# EAGLE board DVRpowerSupply (EAGLE 6.5.0)
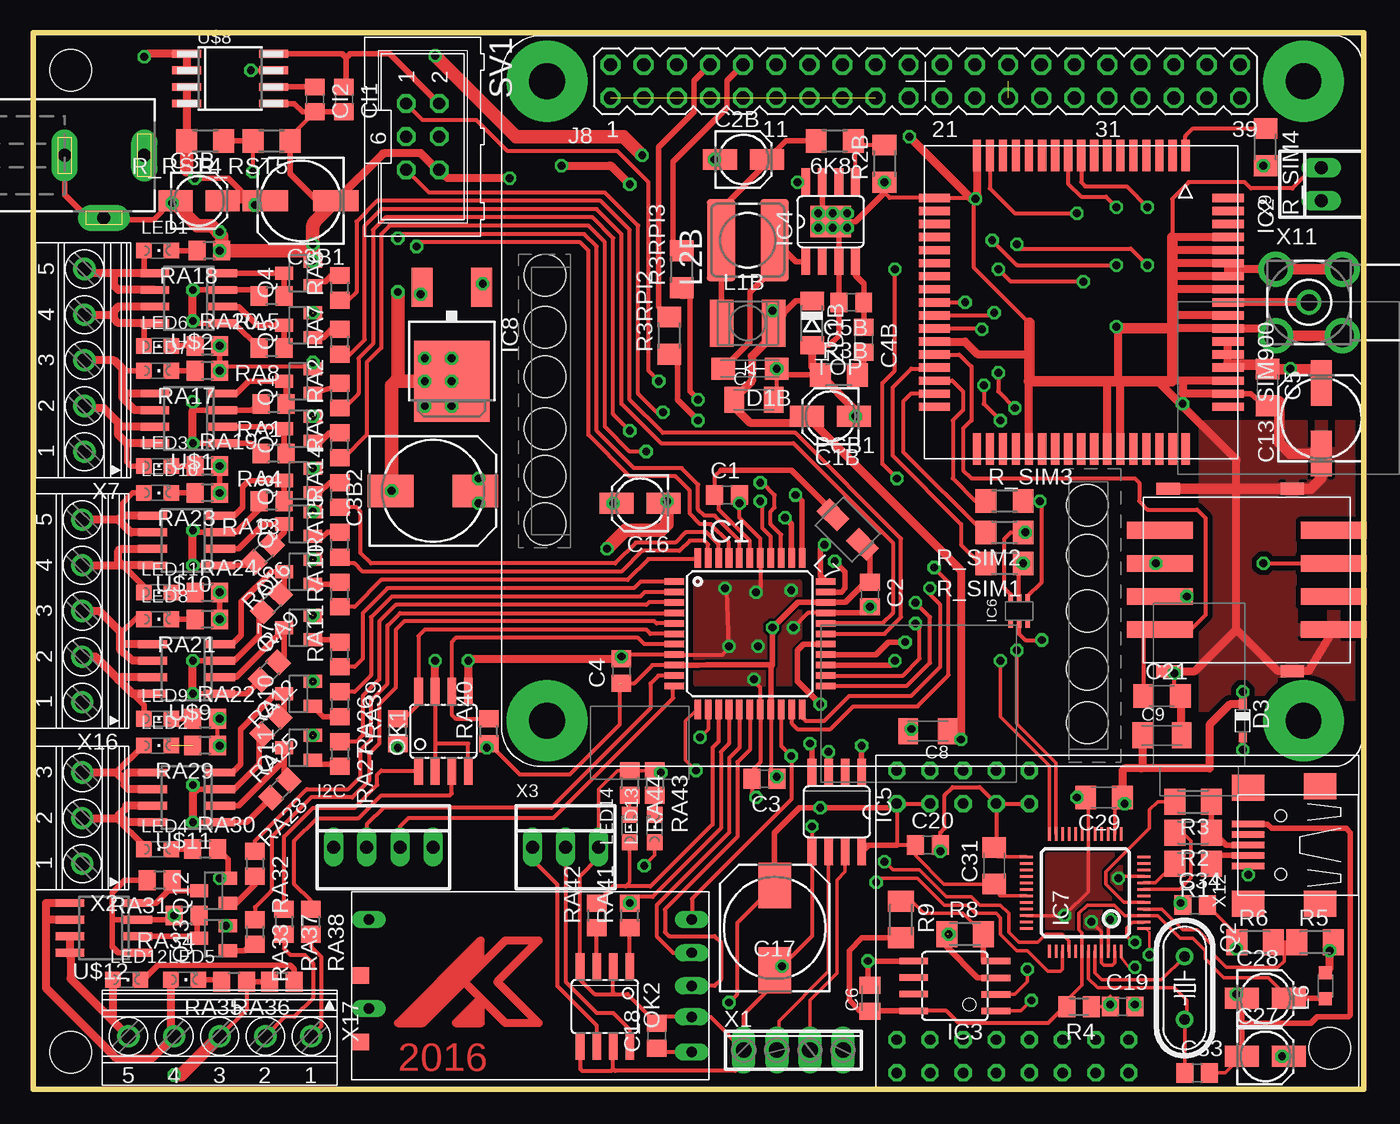
[diagram p2: board, top side]
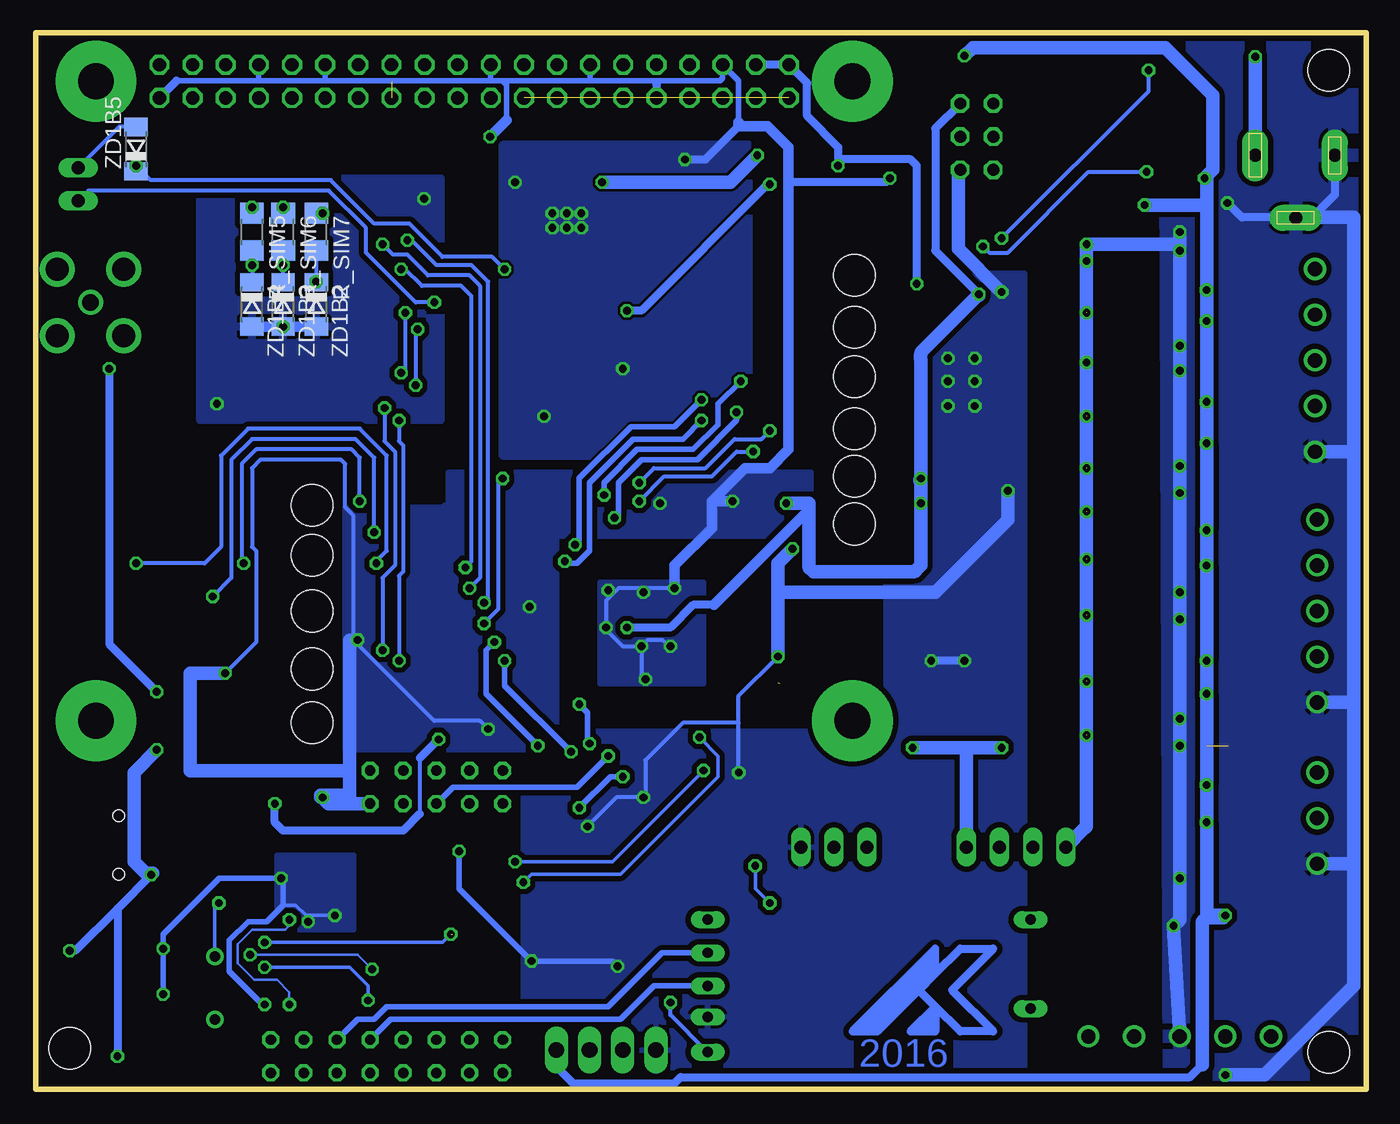
[diagram p3: board, bottom side, seen from below]

Size 102 x 81 mm. Coordinates in mm from the lower left corner, seen from the top.
Outline: 0,0 102,0 102,81 0,81 0,0
Copper layers (1*16): Top 0.035mm / dielectric 1.5mm / Bottom 0.035mm
Design rules "default *": minimum track width 10mil, minimum drill 22mil, track to track 8mil, track to pad 8mil, pad to pad 8mil, via to via 8mil, smd to smd 0mil, copper to edge 8mil, drill to drill 8mil, minimum pad ring 10mil, minimum via ring 8mil, stop-mask expansion 4mil, vias tented up to drill 10mil, thermal gap 10mil
Holes 3.2 mm at 2.86,78.11 2.86,2.86 99.38,3.17 39.21,62.39 39.21,58.42 39.21,54.61 39.21,50.64 39.21,46.99 39.21,43.34 80.8,44.77 80.8,40.96 80.8,36.67 80.8,32.23 80.8,28.1

## Footprints (pad centres in the part's own frame; a part is rotated, then mirrored left to right if it is on the bottom)
R1206 = smd 1.6 x 1.803: 1 -1.422,0; 2 1.422,0
C0805 = smd 1.3 x 1.5: 1 -0.95,0; 2 0.95,0
153CLV-0405 = smd 2.6 x 1.6: + 1.8,0; - -1.8,0
153CLV-0605 = smd 3.5 x 1.6: + 2.7,0; - -2.7,0
150CLZ-0810 = smd 3.5 x 2.5: + 3.25,0; - -3.25,0
C1206 = smd 1.6 x 1.8: 1 -1.4,0; 2 1.4,0
C0805K = smd 1.3 x 1.6: 1 -1,0; 2 1,0
C1206K = smd 1.5 x 2: 1 -1.5,0; 2 1.5,0
140CLH-0810 = smd 3.5 x 2.5: + 3.25,0; - -3.25,0
SMA-DO214AC = smd 1.8 x 1.7: A -2.05,0; K 2.05,0
SOD323_ST = smd 0.8 x 0.6: A 1.25,0; C -1.25,0
22-23-2041 = drill 1 long: 1 -3.81,0; 2 -1.27,0; 3 1.27,0; 4 3.81,0
TQFP44 = smd 1.5 x 0.5: 1 -5.8,4; 2 -5.8,3.2; 3 -5.8,2.4; 4 -5.8,1.6; 5 -5.8,0.8; 6 -5.8,0; 7 -5.8,-0.8; 8 -5.8,-1.6; 9 -5.8,-2.4; 10 -5.8,-3.2; 11 -5.8,-4; 23 5.8,-4; 24 5.8,-3.2; 25 5.8,-2.4; 26 5.8,-1.6; 27 5.8,-0.8; 28 5.8,0; 29 5.8,0.8; 30 5.8,1.6; 31 5.8,2.4; 32 5.8,3.2; 33 5.8,4 | smd 0.5 x 1.5: 12 -4,-5.8; 13 -3.2,-5.8; 14 -2.4,-5.8; 15 -1.6,-5.8; 16 -0.8,-5.8; 17 0,-5.8; 18 0.8,-5.8; 19 1.6,-5.8; 20 2.4,-5.8; 21 3.2,-5.8; 22 4,-5.8; 34 4,5.8; 35 3.2,5.8; 36 2.4,5.8; 37 1.6,5.8; 38 0.8,5.8; 39 0,5.8; 40 -0.8,5.8; 41 -1.6,5.8; 42 -2.4,5.8; 43 -3.2,5.8; 44 -4,5.8
SIM900 = smd 2.413 x 0.635: 1 -11.25,8; 2 -11.25,7; 3 -11.25,6; 4 -11.25,5; 5 -11.25,4; 6 -11.25,3; 7 -11.25,2; 8 -11.25,1; 9 -11.25,0; 10 -11.25,-1; 11 -11.25,-2; 12 -11.25,-3; 13 -11.25,-4; 14 -11.25,-5; 15 -11.25,-6; 16 -11.25,-7; 17 -11.25,-8; 35 11.25,-8; 36 11.25,-7; 37 11.25,-6; 38 11.25,-5; 39 11.25,-4; 40 11.25,-3; 41 11.25,-2; 42 11.25,-1; 43 11.25,0; 44 11.25,1; 45 11.25,2; 46 11.25,3; 47 11.25,4; 48 11.25,5; 49 11.25,6; 50 11.25,7; 51 11.25,8 | smd 0.635 x 2.413: 18 -8,-11.25; 19 -7,-11.25; 20 -6,-11.25; 21 -5,-11.25; 22 -4,-11.25; 23 -3,-11.25; 24 -2,-11.25; 25 -1,-11.25; 26 0,-11.25; 27 1,-11.25; 28 2,-11.25; 29 3,-11.25; 30 4,-11.25; 31 5,-11.25; 32 6,-11.25; 33 7,-11.25; 34 8,-11.25; 52 8,11.25; 53 7,11.25; 54 6,11.25; 55 5,11.25; 56 4,11.25; 57 3,11.25; 58 2,11.25; 59 1,11.25; 60 0,11.25; 61 -1,11.25; 62 -2,11.25; 63 -3,11.25; 64 -4,11.25; 65 -5,11.25; 66 -6,11.25; 67 -7,11.25; 68 -8,11.25
SOIC8 = smd 0.5 x 2.2: 1 -1.905,-3.154; 2 -0.645,-3.154; 3 0.625,-3.154; 4 1.895,-3.154; 5 1.905,3.154; 6 0.635,3.154; 7 -0.635,3.154; 8 -1.905,3.154
HSOP8-PAD = smd 0.66 x 2.032: 1 -1.905,-3.073; 2 -0.635,-3.073; 3 0.635,-3.073; 4 1.905,-3.073; 5 1.905,3.073; 6 0.635,3.073; 7 -0.635,3.073; 8 -1.905,3.073 | smd 3.1 x 2.41: P 0,0
SO08 = smd 0.66 x 2.032: 1 -1.905,-3.073; 2 -0.635,-3.073; 3 0.635,-3.073; 4 1.905,-3.073; 5 1.905,3.073; 6 0.635,3.073; 7 -0.635,3.073; 8 -1.905,3.073
SC-70-6 = smd 0.35 x 0.5: 1 -0.65,-1.05; 2 0,-1.05; 3 0.65,-1.05; 4 0.65,1.05; 5 0,1.05; 6 -0.65,1.05
LQFP = smd 0.2 x 1: 1 -2.75,-4.5; 2 -2.25,-4.5; 3 -1.75,-4.5; 4 -1.25,-4.5; 5 -0.75,-4.5; 6 -0.25,-4.5; 7 0.25,-4.5; 8 0.75,-4.5; 9 1.25,-4.5; 10 1.75,-4.5; 11 2.25,-4.5; 12 2.75,-4.5; 25 2.75,4.5; 26 2.25,4.5; 27 1.75,4.5; 28 1.25,4.5; 29 0.75,4.5; 30 0.25,4.5; 31 -0.25,4.5; 32 -0.75,4.5; 33 -1.25,4.5; 34 -1.75,4.5; 35 -2.25,4.5; 36 -2.75,4.5 | smd 1 x 0.2: 13 4.5,-2.75; 14 4.5,-2.25; 15 4.5,-1.75; 16 4.5,-1.25; 17 4.5,-0.75; 18 4.5,-0.25; 19 4.5,0.25; 20 4.5,0.75; 21 4.5,1.25; 22 4.5,1.75; 23 4.5,2.25; 24 4.5,2.75; 37 -4.5,2.75; 38 -4.5,2.25; 39 -4.5,1.75; 40 -4.5,1.25; 41 -4.5,0.75; 42 -4.5,0.25; 43 -4.5,-0.25; 44 -4.5,-0.75; 45 -4.5,-1.25; 46 -4.5,-1.75; 47 -4.5,-2.25; 48 -4.5,-2.75
DPACK = smd 1.6 x 3: 1 -2.28,-4.8; 3 2.28,-4.8 | smd 5.8 x 6.2: 4 0,2.38
DCJ0303 = drill 1 pad 2 long: 1 0,3.1; 2 4.8,0; 3 0,-3
L4532P = smd 1.8 x 3.6: 1 -2,0; 2 2,0
POWER-CHOKE_WE-TPC = smd 6.3 x 2.2: 1 0,2.05; 2 0,-2.05
L2012C = smd 1 x 1: 1 -1,0; 2 1,0
L4035M = smd 2.2 x 1.4: 1 -1.6,0; 2 1.6,0
CHIPLED_0805 = smd 1.2 x 1.2: A 0,-1.05; C 0,1.05
SOIC08 = smd 0.66 x 2.032: 1 -1.905,-3.073; 2 -0.635,-3.073; 3 0.635,-3.073; 4 1.905,-3.073; 5 1.905,3.073; 6 0.635,3.073; 7 -0.635,3.073; 8 -1.905,3.073
RASPBERRY_PI_APLUS_TPLACE = drill 1.016 octagon: 1 8.37,51.23; 2 8.37,53.77; 3 10.91,51.23; 4 10.91,53.77; 5 13.45,51.23; 6 13.45,53.77; 7 15.99,51.23; 8 15.99,53.77; 9 18.53,51.23; 10 18.53,53.77; 11 21.07,51.23; 12 21.07,53.77; 13 23.61,51.23; 14 23.61,53.77; 15 26.15,51.23; 16 26.15,53.77; 17 28.69,51.23; 18 28.69,53.77; 19 31.23,51.23; 20 31.23,53.77; 21 33.77,51.23; 22 33.77,53.77; 23 36.31,51.23; 24 36.31,53.77; 25 38.85,51.23; 26 38.85,53.77; 27 41.39,51.23; 28 41.39,53.77; 29 43.93,51.23; 30 43.93,53.77; 31 46.47,51.23; 32 46.47,53.77; 33 49.01,51.23; 34 49.01,53.77; 35 51.55,51.23; 36 51.55,53.77; 37 54.09,51.23; 38 54.09,53.77; 39 56.63,51.23; 40 56.63,53.77 | drill 2.75 pad 6.2: PE_BL 3.5,3.5; PE_BR 61.5,3.5; PE_TL 3.5,52.5; PE_TR 61.5,52.5
SOT23 = smd 1 x 1.4: 1 -0.95,-1.1; 2 0.95,-1.1; 3 0,1.1
HC49/S = drill 0.813: 1 -2.413,0; 2 2.413,0
M1206 = smd 1.6 x 2: 1 -1.4,0; 2 1.4,0
M0805 = smd 1.3 x 1.6: 1 -0.95,0; 2 0.95,0
R0805 = smd 1.3 x 1.5: 1 -0.95,0; 2 0.95,0
ML6 = drill 0.914 octagon: 1 -2.54,-1.27; 2 -2.54,1.27; 3 0,-1.27; 4 0,1.27; 5 2.54,-1.27; 6 2.54,1.27
SO-08 = smd 0.6 x 2.2: 1 -1.905,-2.6; 2 -0.635,-2.6; 3 0.635,-2.6; 4 1.905,-2.6; 5 1.905,2.6; 6 0.635,2.6; 7 -0.635,2.6; 8 -1.905,2.6
HC-12 = drill 0.8 long: P$1 -12.383,5.08; P$2 -12.383,2.381; P$3 -12.383,0; P$4 -12.383,-2.54; P$5 -12.383,-5.08; P$6 12.383,1.746; P$9 12.383,-5.08 | smd 1.27 x 1.27: P$7 13.018,4.286; P$8 13.018,-0.794
XCORE2530 = drill 0.8 octagon: P$1 1.587,1.27; P$1B 1.587,21.907; P$2 1.587,3.81; P$2B 1.587,24.448; P$3 4.128,1.27; P$3B 4.128,21.907; P$4 4.128,3.81; P$4B 4.128,24.448; P$5 6.668,1.27; P$5B 6.668,21.907; P$6 6.668,3.81; P$6B 6.668,24.448; P$7 9.207,1.27; P$7B 9.207,21.907; P$8 9.207,3.81; P$8B 9.207,24.448; P$9 11.748,1.27; P$9B 11.748,21.907; P$10 11.748,3.81; P$10B 11.748,24.448; P$11 14.287,1.27; P$12 14.287,3.81; P$13 16.828,1.27; P$14 16.828,3.81; P$15 19.367,1.27; P$16 19.367,3.81
115R-BCA0 = smd 5.08 x 1.27: C1 1.27,0; C2 1.27,2.54; C3 1.27,5.08; C4 1.27,7.62; C5 14.605,0; C6 14.605,2.54; C7 14.605,5.08; C8 14.605,7.62 | smd 1.778 x 0.914: P$1 1.905,10.795; P$2 1.905,-3.175; P$3 11.43,-3.175; P$4 11.43,10.795
SO-08M = smd 0.6 x 2.2: 1 -1.905,-3.33; 2 -0.635,-3.33; 3 0.635,-3.33; 4 1.905,-3.33; 5 1.905,3.33; 6 0.635,3.33; 7 -0.635,3.33; 8 -1.905,3.33
4POL254 = drill 1.2 long: 1 -3.81,0; 2 -1.27,0; 3 1.27,0; 4 3.81,0
1751251 = drill 1.1 pad 1.7: 1 -3.5,-0.1; 2 0,-0.1; 3 3.5,-0.1
22-23-2031 = drill 1 long: 1 -2.54,0; 2 0,0; 3 2.54,0
1751277 = drill 1.1 pad 1.7: 1 -7,-0.1; 2 -3.5,-0.1; 3 0,-0.1; 4 3.5,-0.1; 5 7,-0.1
22-23-2021 = drill 1 long: 1 -1.27,0; 2 1.27,0
BU-SMA-H = drill 1.27: 1 0,0 | drill 1.778: 2 -2.55,2.55; 3 2.55,2.55; 4 2.55,-2.55; 5 -2.55,-2.55
USB-M-S1 = smd 2.5 x 0.5: D+ 2.75,0; D- 2.75,0.8; GND 2.75,-1.6; ID 2.75,-0.8; VBUS 2.75,1.6 | smd 2.5 x 2: GND@1 -2.75,-4.5; GND@2 -2.75,4.5; GND@3 2.75,-4.4; GND@4 2.75,4.5 | hole 0.9: 0.25,2.25; 0.25,-2.25
SOD80C = smd 1.4 x 1.8: A 1.7,0; C -1.7,0

## Placement (x,y rotation side)
6K8  5k6  [R1206]  61.44,72.71 180 top
C1  [C0805]  53.18,45.56 0 top
C1B  [153CLV-0405]  61.12,51.59 180 top
C2  [C0805]  64.14,37.94 270 top
C2B  [153CLV-0405]  54.45,71.28 0 top
C3  [C0805]  56.04,23.81 180 top
C3B  [153CLV-0405]  12.7,68.1 0 top
C3B1  [153CLV-0605]  20.48,68.1 180 top
C3B2  [150CLZ-0810]  30.64,45.88 0 top
C4  [C0805]  45.09,32.07 90 top
C4B  22nF  [C0805]  63.66,57.47 270 top
C5  100nF  [C1206]  94.61,53.82 270 top
C5B  220pF  [C0805]  62.71,60.33 180 top
C6  [C0805K]  64.14,6.99 90 top
C7  [C1206K]  55.24,52.86 0 top
C8  [C1206K]  68.58,27.46 180 top
C9  [C1206K]  86.52,27.15 0 top
C13  [153CLV-0605]  98.74,51.44 90 top
C16  [153CLV-0405]  46.51,44.93 180 top
C17  [140CLH-0810]  56.83,12.38 90 top
C18  [C0805]  47.78,4.13 90 top
C19  [C0805]  83.5,6.35 0 top
C20  [C0805]  68.58,18.73 0 top
C21  100nF  [C1206]  86.52,30.16 0 top
C27  [153CLV-0405]  94.46,2.54 0 top
C28  [153CLV-0405]  94.46,6.99 0 top
C29  [C1206]  82.07,22.38 180 top
C31  [C1206]  73.66,17.14 90 top
C33  12pf  [C0805]  89.22,1.27 0 top
C34  12pf  [C0805]  89.06,14.13 0 top
CI1  100nF  [C0805]  23.81,75.88 270 top
CI2  1nF  [C0805]  21.59,75.88 270 top
D1B  B350A-13-F  [SMA-DO214AC]  54.93,55.24 180 top
D3  BAT60J  [SOD323_ST]  92.71,28.26 270 top
I2C  [22-23-2041]  26.83,18.57 0 top
IC1  XMEGA16A4A  [TQFP44]  54.93,34.92 0 top
IC2  SIM900  [SIM900]  80.33,60.33 270 top
IC3  AT93C46A-10SQ-2.7  [SOIC8]  70.64,7.94 90 top
IC4  L5973D  [HSOP8-PAD]  61.12,66.52 0 top
IC5  MAX481CSA  [SO08]  61.59,21.27 180 top
IC6  SMF05C  [SC-70-6]  75.56,36.67 0 top
IC7  [LQFP]  80.64,15.08 90 top
IC8  LP2950CDTX-3.3  [DPACK]  32.07,56.67 180 top
J1  [DCJ0303]  5.4,71.6 270 top
L1B  47@1000  [L4532P]  54.77,58.74 0 top
L2B  15µH  [POWER-CHOKE_WE-TPC]  54.77,65.09 90 top
L6  [L2012C]  99.06,7.94 90 top
L7  [L4035M]  62.44,42.91 135 top
LED1  [CHIPLED_0805]  9.53,64.29 270 top
LED2  [CHIPLED_0805]  9.53,26.35 270 top
LED3  [CHIPLED_0805]  9.53,47.78 270 top
LED4  [CHIPLED_0805]  9.53,18.41 270 top
LED5  [CHIPLED_0805]  11.59,8.41 270 top
LED6  [CHIPLED_0805]  9.53,56.99 270 top
LED7  [CHIPLED_0805]  9.53,55.09 270 top
LED8  [CHIPLED_0805]  9.53,36.04 270 top
LED9  [CHIPLED_0805]  9.53,28.42 270 top
LED10  [CHIPLED_0805]  9.53,45.72 270 top
LED11  [CHIPLED_0805]  9.53,38.1 270 top
LED12  [CHIPLED_0805]  7.14,8.41 270 top
LED13  [CHIPLED_0805]  47.62,20 0 top
LED14  [CHIPLED_0805]  45.72,20 0 top
OK1  ILD211  [SOIC08]  31.43,27.46 0 top
OK2  ILD211  [SOIC08]  43.81,6.35 180 top
PCB1  RASPBERRY_PI_B+TPLACE_A  [RASPBERRY_PI_APLUS_TPLACE]  35.88,24.77 0 top
Q1  BC847SMD  [SOT23]  20.32,54.29 90 top
Q2  [HC49/S]  88.27,7.78 270 top
Q3  BC847SMD  [SOT23]  20.32,50.64 90 top
Q4  BC847SMD  [SOT23]  20.32,62.55 90 top
Q5  BC847SMD  [SOT23]  20.32,58.58 90 top
Q6  BC847SMD  [SOT23]  20.32,39.69 90 top
Q7  BC847SMD  [SOT23]  20.32,35.4 90 top
Q8  BC847SMD  [SOT23]  20.32,46.67 90 top
Q9  BC847SMD  [SOT23]  20.32,43.34 90 top
Q10  BC847SMD  [SOT23]  20.32,30.32 90 top
Q11  BC847SMD  [SOT23]  20.32,26.19 90 top
Q12  BC847SMD  [SOT23]  13.81,15.24 90 top
Q13  BC847SMD  [SOT23]  13.81,11.59 90 top
R1  27  [M1206]  88.9,17.3 180 top
R2  27  [M1206]  88.9,19.68 180 top
R2B  3k3  [R1206]  65.25,70.96 90 top
R3  1k5  [M1206]  88.9,22.07 180 top
R3B  4k7  [R1206]  61.75,54.77 0 top
R3RPI2  1k  [R1206]  48.74,57.78 90 top
R3RPI3  1k  [R1206]  49.69,62.87 90 top
R4  470  [M0805]  80.17,6.35 180 top
R5  4k7  [M1206]  98.27,11.27 0 top
R6  10k  [M1206]  93.66,11.27 0 top
R8  2k2  [M1206]  71.44,11.91 0 top
R9  10k  [M1206]  66.52,13.02 270 top
R_RST4  56k  [R1206]  13.18,72.71 180 top
R_RST5  56k  [R1206]  18.26,72.71 180 top
R_SIM1  22  [R1206]  74.45,40.32 180 top
R_SIM2  22  [R1206]  74.45,42.7 180 top
R_SIM3  22  [R1206]  74.45,45.09 0 top
R_SIM4  1k  [R1206]  94.46,72.23 270 top
R_SIM5  1k  [R1206]  85.41,65.72 270 bottom
R_SIM6  1k  [R1206]  83.03,65.72 270 bottom
R_SIM7  1k  [R1206]  80.49,65.72 270 bottom
RA1  1k  [R0805]  18.41,52.55 180 top
RA2  1k  [R0805]  23.5,53.18 90 top
RA3  1k  [R0805]  23.5,49.37 90 top
RA4  1k  [R0805]  18.41,48.74 180 top
RA5  1k  [R0805]  18.26,60.8 180 top
RA6  1k  [R0805]  23.5,61.44 90 top
RA7  1k  [R0805]  23.5,57.31 90 top
RA8  1k  [R0805]  18.26,56.83 180 top
RA9  1k  [R0805]  18.26,37.31 225 top
RA10  1k  [R0805]  23.5,37.94 90 top
RA11  1k  [R0805]  23.5,33.34 90 top
RA12  1k  [R0805]  18.1,32.07 225 top
RA13  1k  [R0805]  18.26,45.09 180 top
RA14  1k  [R0805]  23.5,45.56 90 top
RA15  1k  [R0805]  23.5,41.75 90 top
RA16  1k  [R0805]  17.62,41.12 225 top
RA17  1k  [R0805]  13.34,55.09 180 top
RA18  1k  [R0805]  13.49,64.29 180 top
RA19  1k  [R0805]  13.34,47.78 0 top
RA20  1k  [R0805]  13.34,56.99 0 top
RA21  1k  [R0805]  13.34,36.04 180 top
RA22  1k  [R0805]  13.18,28.42 0 top
RA23  1k  [R0805]  13.34,45.72 180 top
RA24  1k  [R0805]  13.34,38.1 0 top
RA25  1k  [R0805]  18.21,27.89 225 top
RA26  1k  [R0805]  23.5,29.53 270 top
RA27  1k  [R0805]  23.5,25.72 270 top
RA28  1k  [R0805]  18.89,23.02 225 top
RA29  1k  [R0805]  13.18,26.35 180 top
RA30  1k  [R0805]  13.18,18.41 0 top
RA31  1k  [R0805]  9.68,16.03 180 top
RA32  1k  [R0805]  16.99,17.3 270 top
RA33  1k  [R0805]  16.99,12.06 270 top
RA34  1k  [R0805]  11.75,13.34 180 top
RA35  1k  [R0805]  15.4,8.26 180 top
RA36  1k  [R0805]  19.05,8.26 180 top
RA37  1k  [R0805]  19.21,12.86 270 top
RA38  1k  [R0805]  21.27,12.86 270 top
RA39  1k  [R0805]  27.94,27.46 90 top
RA40  1k  [R0805]  34.92,27.46 90 top
RA41  1k  [R0805]  45.72,13.34 90 top
RA42  1k  [R0805]  43.18,13.34 90 top
RA43  1k  [R0805]  47.62,23.5 270 top
RA44  1k  [R0805]  45.72,23.5 270 top
SV1  [ML6]  29.84,73.03 270 top
U$1  AO4801A  [SO-08]  11.91,51.44 90 top
U$2  AO4801A  [SO-08]  11.91,60.64 90 top
U$3  HC-12  [HC-12]  38.1,7.94 180 top
U$4  XCORE2530  [XCORE2530]  64.61,0 0 top
U$5  [LOGO]  34.29,5.71 0 top
U$6  [LOGO]  33.02,5.08 0 bottom
U$7  SCU-W0822XR-06115R-BCA0  [115R-BCA0]  85.09,35.24 0 top
U$8  ACS712SO8  [SO-08M]  15.08,77.47 270 top
U$9  AO4801A  [SO-08]  11.75,32.23 90 top
U$10  AO4801A  [SO-08]  11.75,42.07 90 top
U$11  AO4801A  [SO-08]  11.75,22.38 90 top
U$12  AO4801A  [SO-08]  5.4,12.38 90 top
X1  [4POL254]  58.26,3.02 0 top
X2  1751251  [1751251]  3.65,20.8 90 top
X3  22-23-2031  [22-23-2031]  40.8,18.57 0 top
X7  1751277  [1751277]  3.81,55.88 90 top
X9  22-23-2021  [22-23-2021]  98.74,69.37 90 top
X11  BU-SMA-H  [BU-SMA-H]  97.79,60.33 0 top
X12  [USB-M-S1]  95.89,18.73 180 top
X16  1751277  [1751277]  3.65,36.67 90 top
X17  1751277  [1751277]  14.29,3.97 180 top
ZD1B  5V1  [SOD80C]  59.69,58.74 270 top
ZD1B2  3v6  [SOD80C]  80.49,60.17 270 bottom
ZD1B3  3v6  [SOD80C]  83.03,60.17 270 bottom
ZD1B4  3v6  [SOD80C]  85.41,60.17 270 bottom
ZD1B5  3v6  [SOD80C]  94.3,72.07 90 bottom

## Tracks (layer width: path | path; a pad name or v marks a point on that pad's centre or on a via)
3V3  (1 unrouted)
+3V3  (via drill 0.6)  (1 unrouted)
  Top 0.254: IC7.31 74.1,14.83 C31.1 69.82,15.74 67.63,17.94 C20.1
  Top 0.305: IC1.9 47.45,32.52 46.04,31.11 C4.1 | 44.93,31.11 44.93,27.94 41.12,24.13 37.31,24.13 RA40.1 34.92,26.19 v34.77,26.19 | IC1.19 56.53,24.27 C3.1 | U$4.P$3B U$4.P$1B 66.2,18.73 C20.1 | U$3.P$1 48.1,2.86 C18.1 | v53.34,6.67 53.98,7.3 53.98,12.78 C17.+ | RA39.1 v27.94,26.19
  Top 0.406: 64.14,39.21 62.25,37.33 IC1.31 58.6,37.33 v56.67,35.4 56.67,32.54 | 64.14,39.21 C2.1 64.14,39.21 | IC1.9 50.98,32.52 51.59,32.54 56.67,32.54 | IC1.19 56.53,32.53 56.59,32.46 56.67,32.54 | 64.14,39.21 64.14,41.43 63.5,42.07 63.27,42.07 L7.1 | U$8.8 23.65,79.38 23.97,79.06 | 23.97,79.06 23.97,76.99 CI1.1 | SV1.2 27.3,79.38 24.29,79.38 23.97,79.06 | 66.2,18.73 64.03,18.73 IC5.8 | C17.+ 56.83,19.68 58.74,21.59 v60.33,21.59 65.88,21.59 U$4.P$1B | C3.1 v56.99,23.97
  Top 0.61: v29.69,60.96 29.84,60.62 IC8.3
  Top 0.813: C16.+ v44.45,44.93
  Top 1.016: C3B2.+ 34.05,46.33 arc-45 34.12,46.5 v34.13,46.83
  Bottom 0.305: U$3.P$1 53.34,5.71 v53.34,6.67
  Bottom 0.406: v56.99,23.97 57.94,23.97 v60.33,21.59
  Bottom 0.61: SV1.2 33.02,73.66 33.02,64.29 v29.69,60.96 | 50.01,37.15 51.59,37.15 53.34,35.4 v56.67,35.4
  Bottom 0.813: 50.01,37.15 42.7,44.45
  Bottom 1.016: v44.45,44.93 42.7,44.93 42.7,44.45 42.7,40.11 arc-45 42.63,39.93 42.39,39.69 34.71,39.69 arc-45 34.53,39.76 34.13,40.16 v34.13,44.93 34.13,46.57 arc45 34.22,46.75 v34.13,46.83 34.13,55.91 arc45 34.06,56.57 29.76,60.87 arc-45 29.69,60.89 v29.69,60.96 | v27.94,26.19 30.64,26.19 | 30.64,26.19 v34.77,26.19 | I2C.4 30.64,26.19
+5V  (via drill 0.6)
  Top 0.254: IC7.14 82.89,21.8 C29.1 83.47,23.15
  Top 0.305: 83.5,22.41 C29.1 83.66,22.2 v83.66,21.91 | IC2.55 96.92,55.33 v96.36,55.24 | C8.1 70.48,27.46 v71.12,26.83
  Top 0.406: ZD1B.C 58.47,60.44 57.44,59.4 L1B.2 56.77,57.88
  Top 0.61: 56.77,57.88 55.09,56.2 55.09,54.29 53.82,53.02 53.82,52.86 | 53.82,52.86 53.82,52.23 54.93,51.12 58.9,51.12 59.32,51.54 C1B.+ 71.12,39.79 v71.12,26.83 | 91.58,55.53 IC2.55 IC2.56 IC2.57 | IC8.1 34.35,62.29 v34.45,61.75 | v40.48,70.8 44.19,70.8 arc-45 44.37,70.73 v45.72,69.37 | v56.67,59.69 57.15,59.69 57.44,59.4 | 84.93,24.61 90.17,24.61 90.17,27.94 91.74,29.51 D3.C v92.71,30.48 | 84.93,24.61 83.66,24.61 83.5,24.45 83.5,22.41 | C9.1 85.02,24.69 84.93,24.61 | C7.1 53.82,52.86
  Top 0.813: 91.58,55.53 94.59,55.53 94.61,55.56 C5.1 98.74,55.22 C13.+
  Bottom 0.305: 72.55,25.4 72.55,21.11
  Bottom 0.61: v34.45,61.75 34.45,70.8 34.92,71.28 40.48,71.28 v40.48,70.8 40.48,72.23 42.86,74.61 42.86,77.15 PCB1.2 PCB1.4 | v45.72,69.37 45.88,69.37 55.56,59.69 v56.67,59.69 | v71.12,26.83 72.55,25.4 | 72.55,21.11 73.82,19.84 83.03,19.84 83.66,20.48 v83.66,21.91 | v96.36,55.24 96.36,34.13 v92.71,30.48
+12V  (via drill 0.6)
  Top 0.406: RA1.2 16.67,52.07 U$1.3 12.22,52.07 v12.22,52.7 | v12.22,49.53 U$1.1 16.67,49.53 RA4.2 | RA5.2 16.83,61.28 U$2.3 v12.22,61.28 | RA8.2 15.4,58.74 U$2.1 12.22,58.74 v12.22,58.9 | 15.56,42.7 U$10.3 12.38,42.7 | 15.56,42.7 | 15.56,42.7 17.31,44.45 RA13.2 | 17.14,40.16 17.15,40.16 RA16.2 17.3,40.01 17.14,40.16 | U$9.1 12.54,30.32 | 12.38,42.7 12.22,42.7 | v12.22,40.16 U$10.1 17.14,40.16 | v12.22,32.86 U$9.3 15.4,32.86 17.3,34.77 17.31,36.35 RA9.2 | U$9.1 16.35,30.32 RA12.2 | RA25.2 17.3,26.67 17.3,24.92 15.4,23.02 U$11.3 12.54,23.02 | U$11.1 16.35,20.48 RA28.2 | RA31.2 6.99,16.03 6.03,15.08 6.03,13.02 | 6.03,13.02 6.03,10.95 6.51,10.48 U$12.1 | 6.03,13.02 U$12.3 10.48,13.02 RA34.2 v10.79,13.34 | 12.54,69.85 v12.38,69.85 12.38,69.69 12.54,69.85 | 12.54,69.85 14.92,69.85 15.88,68.9 15.88,68.16 C3B.+ C3B1.+ | 11.75,72.23 R_RST4.2 | 12.22,20.8 12.54,20.48 U$11.1 | U$11.1 v12.22,20.48 | U$9.1 v12.22,30.32 | v12.22,42.86 12.38,42.7
  Top 0.61: 12.54,30.32 12.22,30.64 v12.22,32.86 | v12.22,40.16 12.22,42.7 | v12.22,49.53 12.22,52.07 | v12.22,58.9 v12.22,61.28 | 11.75,70.48 v12.38,69.85 | U$8.3 U$8.4 11.75,72.23 | 12.22,20.8 12.22,22.7 12.54,23.02 v12.22,23.34 | 10.48,13.02 RA34.2 v10.79,13.34 | IC4.8 58.64,69.59 v58.58,69.53
  Top 1.016: R_RST4.2 11.75,70.48 | v46.67,71.6 45.24,73.03 36.99,73.03 v30.8,79.22
  Bottom 0.61: 12.22,69.69 v12.38,69.85 | X1.4 62.07,1.75 60.8,0.48 53.02,0.48 52.55,0.95 13.49,0.95 12.54,1.91 | v10.79,13.34 10.96,13.18
  Bottom 1.016: 12.22,67.79 v12.22,61.28 v12.22,58.9 v12.22,52.7 v12.22,49.53 v12.22,42.86 v12.22,40.16 v12.22,32.86 v12.22,30.32 v12.22,23.34 v12.22,20.48 12.22,13.34 v10.79,13.34 | 12.22,67.79 12.22,69.69 | 12.54,1.91 12.54,12.86 12.22,13.18 10.96,13.18 | v58.58,69.53 48.74,69.53 v46.67,71.6 | v30.8,79.22 30.16,79.85 15.4,79.85 11.75,76.2 11.75,70.48 v12.38,69.85 | 12.22,67.79 v16.99,67.79
AVCC
  Top 0.254: 52.55,45.08 C1.1
  Top 0.305: IC1.39 54.93,42.07 52.55,44.45 52.55,45.08 | 52.7,47.47 52.23,46.99 52.23,45.09 C1.1
  Top 0.406: 52.7,47.47 58.1,47.47 61.82,43.74 61.73,43.65 L7.2
COMP2
  Top 0.406: IC4.4 63.02,62.39 63.66,61.75 C5B.1 63.66,58.26 C4B.1
CPU_RST  (via drill 0.6)
  Top 0.305: v48.26,51.91 47.78,51.91 46.35,53.34 46.35,66.2 43.81,68.74 30.32,68.74 SV1.5
  Top 0.406: IC1.35 58.13,43.31 v57.63,43.81
  Bottom 0.406: v57.63,43.81 57.31,44.13 57.31,46.51 55.56,48.26 51.28,48.26 48.26,51.28 v48.26,51.91
DBG_RX  (via drill 0.6)
  Top 0.254: IC7.24 77.89,24.82 74.14,28.57 v74.14,32.86
  Top 0.305: IC2.28 72.61,58.33 v72.71,58.26 | v72.87,53.98 72.87,52.55 v74.14,51.28
  Bottom 0.305: v72.71,58.26 72.87,58.1 v72.87,53.98 | v74.14,51.28 74.14,49.69 73.82,49.37 73.82,39.69 74.14,39.37 v74.14,32.86
DBG_TX  (via drill 0.6)
  Top 0.254: IC7.23 78.39,25.05 75.41,28.04 v75.41,33.66
  Top 0.305: IC2.27 73.45,59.33 v73.66,59.53 | v73.98,54.93 73.98,53.5 v75.25,52.23
  Bottom 0.305: v73.66,59.53 73.66,55.24 v73.98,54.93 | v75.25,52.23 75.25,49.69 74.45,48.9 74.45,40.16 75.41,39.21 v75.41,33.66
FD_DI  (via drill 0.6)  (1 unrouted)
  Top 0.254: IC7.2 84.27,12.83 83.82,12.38 83.82,11.75 84.3,11.27 v84.45,11.27
  Top 0.406: R8.1 70.04,10.93 72.39,8.57 73.79,8.57 IC3.3
  Bottom 0.254: v84.45,11.27 70.8,11.27 v70.17,11.91
FT_AVCC  (via drill 0.6)
  Top 0.254: R4.1 C19.1 82.55,7.14 v82.55,6.51 | IC7.46 82.39,12.86 v82.55,13.02
  Bottom 0.203: v82.55,13.02 82.55,12.54 82.87,12.22 85.41,12.22 86.52,11.11 86.52,9.68 85.25,8.41 83.5,8.41 82.55,7.46 v82.55,6.51
FT_CS  (via drill 0.6)
  Top 0.203: IC7.48 83.39,10.11 83.98,9.37 v84.45,9.37
  Top 0.254: v76.52,6.83 75.72,6.03 IC3.1
  Bottom 0.254: v84.45,9.37 77.95,9.37 76.52,7.94 v76.52,6.83
FT_DO
  Top 0.254: R9.1 67.34,14.42 68.26,13.49 71.28,13.49 72.23,12.54 73.18,12.41 R8.2
  Top 0.406: R8.2 72.84,9.84 IC3.4
FT_SK  (via drill 0.6)
  Top 0.203: IC7.1 85.3,12.33 85.57,12.06 v85.57,10.32
  Top 0.254: v76.2,9.21 76.2,8.26 75.25,7.3 73.81,7.3 IC3.2
  Bottom 0.203: v85.57,10.32 77.31,10.32 v76.2,9.21
FT_VCC
  Top 0.254: R4.2 79.22,6.83 80.39,8.01 IC7.42 80.39,12 80.17,12.22 80.17,13.49 80.8,14.13 82.87,14.13 83.67,13.33 IC7.3 86.2,13.33 87.95,11.59 88.9,11.59 89.85,10.64 89.85,10 91.28,8.57 94.67,8.57 C28.+
  Top 0.305: R4.2 79.06,6.35 77.79,5.08 70.96,5.08 70.01,6.03 IC3.8
  Top 0.406: L6.1 99.06,6.99 C28.+ | IC3.8 64.18,6.03 C6.1 64.09,6.03 63.34,6.03 62.55,6.83 62.55,10.64 63.53,11.62 R9.2
GND  (via drill 0.6)  (13 unrouted)
  Top 0.254: C28.- 92.26,7.38 92.26,7.43 v92.23,7.3 | C33.2 91.39,1.27 C27.- | 92.26,11.88 C34.2 | C19.2 v84.45,6.51 | v81.12,12.86 81.89,12.09 IC7.45 81.89,9.7 82.07,9.53 82.71,9.53 82.89,9.71 IC7.47 | IC7.34 v79.05,13.33 v79.06,13.34 80.89,15.17 IC7.18 80.89,22.16 C29.2 v80.01,22.38 | v92.23,10.79 92.23,11.24 R6.1 | IC7.9 83.32,16.33 | IC7.25 73.9,17.83 C31.2 73.18,18.57 73.58,18.97 | 92.23,48.26 92.39,48.42 92.08,48.42 | 83.19,58.42 83.03,58.42 | RA43.1 RA44.1 44.77,24.45 43.34,23.02 X3.3
  Top 0.305: C4.2 45.39,33.33 IC1.8 52.85,33.33 v53.34,33.97 53.18,38.26 v53.02,38.42 | v55.24,31.43 55.24,31.27 55.73,30.79 IC1.18 55.73,25.09 55.09,24.45 C3.2 55.09,22.7 v55.4,22.38 | IC1.30 59.38,36.52 v58.26,35.4 | v55.4,38.1 55.73,38.42 IC1.38 55.73,42.22 54.13,43.81 v54.13,44.93 54.13,45.08 C1.2 | U$4.P$7B U$4.P$9B | U$4.P$7B 73.82,19.21 73.58,18.97 | C20.2 69.53,19.68 69.85,20 69.85,22.54 70.48,23.18 72.55,23.18 U$4.P$7B | 72.33,68.33 IC2.18 65.66,68.33 65.25,68.74 | 72.39,68.1 72.07,67.79 72.07,63.02 76.36,58.74 | C21.2 88.29,30.35 87.47,30.48 v87.47,31.91 | v87.47,31.91 87.47,32.07 | 87.47,32.07 87.95,32.07 | X9.2 98.11,70.64 96.52,69.06 93.34,69.06 92.87,69.53 88.58,69.53 87.31,68.26 87.31,65.33 | IC6.2 75.56,34.92 76.04,34.45 v77.31,34.45 | v87.47,31.91 87.31,31.91 | 87.31,31.91 87.47,32.07 | 83.33,54.28 83.34,54.29 | C13.- 98.74,46.83 | 90.65,46.04 91.76,46.04 | 87.31,31.91 87.15,31.91 U$7.P$2 | RA35.1 16.35,6.13 X17.3 | R_RST5.1 19.68,73.02 CI2.2 | OK1.7 30.8,26.51 | 30.8,26.51 OK1.2 | OK1.4 33.34,26.51 30.8,26.51 | OK2.5 41.91,1.59 42.07,1.43 44.29,1.43 44.45,1.59 | 44.45,1.59 OK2.7 | 44.29,7.3 43.02,7.3 41.91,8.41 OK2.4 41.91,16.35 43.34,17.78 X3.3 | 44.29,7.3 44.45,7.46 OK2.2 | 44.29,7.3 45.56,7.3 C18.2 48.26,5.56 U$3.P$2 51.91,5.56 X1.1 | v59.69,20.16 IC5.5 59.69,11.75 v57.39,9.45 56.83,8.89 | RA43.1 47.95,24.45 v48.1,24.29 | X1.1 54.45,2.06 53.82,1.43 44.61,1.43 44.45,1.59 | C17.- 56.83,8.89 | 56.83,8.89 56.83,8.41 56.83,8.1 54.45,5.71 X1.1 | Q1.2 21.33,55.33 arc45 21.15,55.4 14.71,55.4 arc45 14.53,55.33 RA17.1 | Q13.2 14.61,12.54 arc-45 v14.76,12.54 | Q12.2 v14.29,16.19 arc-45 v14.29,16.19
  Top 0.305: RA22.2 RA29.1 v14.29,26.35 14.5,26.35 | D1B.A arc-45 56.99,55.21 56.99,53.18 56.83,53.02 C7.2 | C8.2 67.15,27.46 v67.31,27.62
  Top 0.406: IC1.30 63.67,36.52 C2.2 | C27.- 92.66,5.08 | 92.66,5.08 C28.- | X12.GND 94.61,20.32 94.93,20 100.65,20 100.97,19.68 100.97,5.71 100.81,5.56 98.42,5.56 97.95,5.08 92.66,5.08 | R6.1 92.26,11.88 | 83.32,16.33 v83.19,16.19 | IC2.53 92.08,53.33 92.08,53.34 93.34,53.34 93.66,53.02 94.14,53.02 94.77,52.39 94.61,52.39 C5.2 | C5B.2 IC4.3 61.75,65.88 | C5B.2 | 61.75,65.88 IC4.P 60.48,67.15 IC4.7 | R2B.1 v65.25,69.53 65.25,68.74 63.02,66.52 62.39,66.52 61.75,65.88 | 59.7,56.87 ZD1B.A 61.01,57.04 61.75,57.78 C5B.2 | R3B.1 57.63,54.77 57.15,55.24 v56.99,55.24 D1B.A | 52.7,71.33 C2B.- | RA20.2 RA17.1 | RA23.1 RA19.2 | 21.42,64.29 Q4.2 | RA24.2 RA21.1 | Q12.2 14.91,17.63 RA30.2 | RA35.1 RA36.2 | U$8.5 20,75.56 20.64,74.93 CI2.2 CI1.2 | J1.3 2.4,68.56 4.13,66.83 5.36,66.83 J1.2 5.52,66.67 9.21,66.67 10.48,67.94 v10.64,67.94 | 11.11,67.94 C3B.- 10.74,68 | RA18.1 | R_RST5.1 19.68,70.17 21.75,68.1 C3B1.- | IC3.5 v63.98,9.84 | 64.14,9.68 v63.98,9.84 | v57.39,9.45 57.39,8.97 56.83,8.41 | C20.2 v69.53,18.26 | C6.2 63.98,8.14 v63.98,9.84
  Top 0.61: 87.31,54.33 IC2.54 88.11,54.33 88.11,53.33 IC2.53 | 87.31,58.33 IC2.58 96.03,58.33 | IC2.61 87.36,61.33 | IC2.63 87.45,63.33 | IC2.65 87.31,65.33 | IC2.64 87.31,64.33 | 83.33,54.29 83.33,54.28 83.33,54.13 | IC2.45 82.33,54.29 | IC2.39 76.33,54.29 | IC2.29 71.42,57.33 72.39,56.36 76.36,56.36 | IC2.59 87.31,59.33 | 87.31,62.33 IC2.62 91.58,62.88 X11.2 | U$7.C5 97.79,32.07 U$7.P$3 95.41,32.07 92.23,35.24 | IC2.46 83.33,54.13 | 68.6,71.58 v67.15,73.03 71.91,68.26 v72.23,68.26 72.33,68.36 IC2.17 | U$7.P$4 91.76,46.04 | 87.95,32.07 89.06,32.07 92.23,35.24 | 92.23,35.24 92.23,48.26 | 92.08,48.42 86.6,53.9 | 86.6,53.9 86.36,54.13 | 83.19,58.42 83.19,54.28 83.33,54.13 | 72.33,68.33 72.33,68.17 72.39,68.1 | v10.64,67.94 11.11,67.94 | 52.7,71.33 52.28,71.33 v52.23,71.28 | C3B1.- 26.76,71.68 arc-45 26.93,71.75 29.69,71.75 30.96,70.48 SV1.6 31.68,69.92 arc45 31.86,69.85 v36.51,69.85 | OK1.7 v30.8,32.86 | OK1.5 v33.34,32.86 33.5,33.02 44.93,33.02 v45.09,33.18 | 87.28,54.29 87,54.29 86.6,53.9 | 59.7,56.87 59.7,55.4 R3B.1 62.92,52.18 C1B.- | C9.2 88.02,30.06 C21.2
  Top 0.813: 87.31,58.33 87.31,54.33 87.28,54.29 83.34,54.29 83.33,54.29 82.33,54.29 76.36,54.29 | 96.03,58.33 X11.5 X11.4 | X11.3 X11.2 | 87.31,58.33 87.31,59.33 87.31,61.28 87.36,61.33 87.31,61.37 87.31,62.33 87.31,63.18 | 87.45,63.33 87.31,63.18 | 87.31,65.33 87.31,64.33 87.31,63.18 | C13.- 96.36,48.74 95.54,49.56 95.54,52.73 C5.2 | 76.33,54.29 76.36,54.29 | 76.36,58.75 76.36,58.74 76.36,56.36 76.36,54.29 | 98.74,46.83 97.95,46.04 | 97.79,46.04 U$7.P$4 90.65,46.04 U$7.P$1 | 87.31,58.33 83.17,58.33 ZD1B3.A | C16.- 48.42,44.93 v48.58,45.09 | 72.33,68.33 72.29,68.33 v72.23,68.26
  Top 1.016: RA18.1 21.42,64.29 21.42,66.08 arc-45 21.65,66.58 C3B1.- | 10.74,68 12.54,66.2 13.65,66.2 14.45,65.41 RA18.1 | v43.97,41.43 45.4,42.86 48.1,42.86 48.58,43.34 v48.58,45.09 | v10.79,1.11 11.33,1.11 X17.3 | Q4.2 21.42,64.28 v21.43,64.77 | 27.86,54.37 27.46,53.97 27.46,45.95 C3B2.- | 27.86,54.37 27.94,54.61 v27.94,61.12 | IC8.4 28.1,54.29 27.86,54.37
  Bottom 0.254: 83.03,14.13 82.07,14.13 81.28,13.34 | v81.12,12.86 81.12,13.18 81.28,13.34 | v79.06,13.34 81.28,13.34 | v83.19,16.19 83.03,16.03
  Bottom 0.305: v53.34,33.97 53.98,34.45 55.09,34.45 v55.56,33.97 | v55.56,33.97 55.56,31.75 v55.24,31.43 | v55.56,33.97 56.99,33.97 58.26,35.24 v58.26,35.4 58.26,37.47 57.31,38.42 55.72,38.42 v55.4,38.1 55.09,38.42 v53.02,38.42 | v87.47,31.91 85.09,34.29 85.09,41.27 85.41,41.59 85.41,47.62 84.77,48.26 78.58,48.26 78.26,47.94 78.26,44.61 77.63,43.97 77.63,34.77 v77.31,34.45 77.31,34.13 71.44,28.26 67.94,28.26 v67.31,27.62 | ZD1B5.A 95.61,73.77 X9.2 | v59.69,20.16 57.47,22.38 v55.4,22.38 55.24,22.54 55.24,25.24 52.39,28.1 48.1,28.1 | v48.1,24.29 48.1,28.1 | 48.1,28.1 48.1,30.16 v45.09,33.18
  Bottom 0.406: 54.13,77.31 49.53,77.31 49.33,77.51 PCB1.6 48.1,77.31 48.1,74.14 | 54.13,77.31 59.37,77.31 | 59.37,77.31 66.2,77.31 | 66.99,77.31 74.77,77.31 | 74.77,77.31 79.85,77.31 | 79.85,77.31 84.77,77.31 | 84.77,77.31 91.19,77.31 | 54.41,77.04 54.13,77.31 | PCB1.14 59.49,77.43 59.37,77.31 | PCB1.20 67.11,77.43 66.99,77.31 | 74.73,77.27 74.77,77.31 | PCB1.30 79.81,77.36 79.85,77.31 | PCB1.34 84.89,77.43 84.77,77.31 | v84.45,6.51 84.77,6.67 87.15,9.05 87.15,11.43 85.72,12.86 84.3,12.86 83.03,14.13 83.03,16.03 | v92.23,7.3 v92.23,10.79 92.23,11.91 87.95,16.19 v83.19,16.19 | 66.99,77.31 66.2,77.31 | 66.2,77.31 65.88,76.99 65.88,74.3 | v57.39,9.45 57.78,9.84 v63.98,9.84 69.53,15.4 v69.53,18.26
  Bottom 0.61: 2.38,71.6 2.38,68.58 4.13,66.83 9.53,66.83 v10.64,67.94 | 54.41,77.04 PCB1.9 | v52.23,71.28 50.64,71.28 48.1,73.82 | 91.19,77.31 PCB1.39 | v36.51,69.85 36.67,69.85 36.76,69.61 arc45 36.94,69.53 44.29,69.53 | v30.8,32.86 v33.34,32.86
  Bottom 0.813: 50.16,45.09 47.62,47.62 45.72,47.62 44.29,49.05 44.29,69.53 44.29,72.23 45.88,73.82 48.1,73.82 48.1,74.14 | ZD1B4.A ZD1B3.A ZD1B2.A | v48.58,45.09 50.16,45.09 | 65.88,74.3 v67.15,73.03 | 50.16,45.09 50.16,43.02 53.02,40.16 v53.02,38.42
  Bottom 1.016: U$4.P$9B 79.53,21.91 v80.01,22.38 | v45.09,33.18 45.09,38.1 | 45.09,38.1 45.09,40.32 v43.97,41.43 | X2.1 0.96,17.3 0.95,17.3 | 0.95,17.3 0.95,29.69 | 0.95,29.69 0.95,48.9 | 0.95,48.9 0.95,66.83 5.36,66.83 J1.2 | X7.1 0.97,48.88 0.95,48.9 | X16.1 0.97,29.67 0.95,29.69 | v10.79,1.11 7.78,1.11 0.95,7.94 0.95,17.3 | I2C.1 21.51,20.09 arc-45 21.43,20.27 v21.43,27.15 v21.43,31.27 v21.43,36.35 v21.43,40.64 v21.43,44.29 v21.43,47.62 v21.43,51.59 v21.43,55.72 v21.43,59.53 v21.43,63.5 v21.43,64.77 14.29,64.77 | v14.29,65.72 14.29,64.77 | 14.29,64.77 v14.29,64.29 RA20.2 RA17.1 RA19.2 RA23.1 RA24.2 RA21.1 v14.29,28.42 v14.29,16.19 14.29,13.02 v14.76,12.54 X17.3 | SV1.6 31.2,70.4 arc-45 31.27,70.22 31.27,64.56 arc-45 31.2,64.38 v27.94,61.12 | 45.09,38.1 33.02,38.1 27.46,43.66 v27.46,45.88 | 77.95,24.45 77.95,34.45 v77.31,34.45 | 80.17,22.38 80.17,22.54 77.95,22.54 77.95,24.45 | 77.95,24.45 90.17,24.45 90.17,31.91 v87.47,31.91
  other vias: 58.1,38.26 83.03,58.47 88.11,52.55 14.29,55.09 14.29,56.99 14.29,47.78 14.29,45.72 14.29,38.1 14.29,36.04 63.02,51.59 60.17,67.15 61.28,67.15 62.39,67.15 60.17,66.04 61.28,66.04 62.39,66.04 64.14,36.99 30,56.04 32.07,56.04 32.07,54.29 30,52.39 32.07,52.39 30,54.29
  pour Top: 50.8,38.73 50.8,31.11 58.74,31.11 58.74,38.89 50.8,38.89
  pour Bottom (isolate 0.406): 50.8,38.89 50.8,31.11 58.74,31.11 58.74,38.89
  pour Top: 77.79,17.94 77.79,12.38 83.34,12.38 83.34,17.94
  pour Bottom (isolate 0.406): 77.63,17.94 77.63,12.22 83.5,12.22 83.5,17.94 77.79,17.94
  pour Bottom (isolate 0.406): 70.96,69.85 70.96,51.28 89.38,51.28 89.38,69.85
  pour Bottom: 47.47,72.39 66.2,72.39 66.2,48.58 47.31,48.58 47.31,72.39
  pour Bottom (isolate 0.406): 0.16,81.12 15.4,81.12 15.08,0.32 0.16,0.32
  pour Bottom (isolate 0.406): 42.55,47.31 70.33,47.31 70.33,44.77 70.64,44.77 70.64,44.61 78.26,44.61 78.26,26.04 59.69,26.04 59.69,27.78 62.07,27.78 62.07,42.39 42.55,42.39
  pour Bottom (isolate 0.406): 26.19,62.55 26.19,0.32 64.61,0.32 64.61,27.46 36.83,27.46 36.83,62.55 26.35,62.55
  pour Top (isolate 0.406): 89.85,50.8 89.85,24.45 101.12,24.45 101.12,50.8
IC4_FB
  Top 0.305: 63.02,69.75 63.02,70.17 63.02,72.55 6K8.1 63.18,72.38 R2B.2
  Top 0.406: 63.02,69.75 IC4.5
N$1
  Top 0.305: X3.1 38.26,17.62 40.16,15.72 40.16,7.94 43.18,4.92 OK2.6
N$2
  Top 0.305: X3.2 40.8,8.26 43.18,5.87 44.45,5.87 45.72,4.6 OK2.8
N$3
  Top 0.406: PCB1.8 50.64,77.31 50.64,74.93 47.94,72.23 47.94,60.01 R3RPI2.2
N$4
  Top 0.406: LED4.A 8.47,18.67 6.35,20.8
  Top 0.61: U$11.8 7.14,20.48 6.67,20.95 6.67,21.11 | U$11.7 7.14,21.75 7.14,21.59 6.67,21.11 | X2.2 6.35,20.8 6.67,21.11
N$5
  Top 0.406: LED7.A 6.99,55.09 6.83,54.93
  Top 0.61: U$1.6 7.78,52.07 6.83,53.02 6.83,53.5 | 6.83,53.5 6.83,54.93 6.83,55.24 6.19,55.88 X7.3 | U$1.5 6.99,53.34 6.83,53.5
N$6
  Top 0.406: LED3.A 7.46,47.78 7.14,48.1 7.14,49.53
  Top 0.61: U$1.8 7.14,49.53 6.51,50.16 6.51,50.64 | 6.51,50.64 6.51,51.12 5.4,52.23 4.06,52.23 X7.2 | U$1.7 6.67,50.8 6.51,50.64
N$7
  Top 0.406: LED7.C RA17.2
N$8
  Top 0.406: LED1.A 8.47,62.61 8.41,62.55
  Top 0.61: U$2.6 6.51,61.28 6.19,61.59 6.19,62.55 | U$2.5 8.41,62.55 6.19,62.55 | 6.19,62.55 4.24,62.55 X7.5
N$9
  Top 0.406: LED2.A 8.4,26.35 6.34,24.3
  Top 0.61: U$11.6 7.3,23.02 6.99,23.34 6.99,23.65 | U$11.5 7.3,24.29 6.99,23.97 6.99,23.65 | X2.3 6.34,24.3 6.99,23.65
N$10
  Top 0.406: U$11.4 15.24,24.29 15.88,24.92 15.88,27.62 18.57,30.32 Q10.3 19.22,28.59 RA25.1
N$11
  Top 0.406: 21.43,76.83 CI2.1 U$8.6
N$12
  Top 0.406: LED6.A 8.47,58.64 8.57,58.74
  Top 0.61: U$2.7 6.51,60.01 6.19,59.69 6.19,59.37 | U$2.8 8.57,58.74 6.51,58.74 6.19,59.05 6.19,59.37 | X7.4 6.18,59.38 6.19,59.37
N$13
  Top 0.254: IC7.8 86.03,15.83 R1.2
N$14
  Top 0.254: IC7.7 87.88,15.33 88.74,16.19 88.74,19.05 88.11,19.68 R2.2
N$15
  Top 0.406: LED8.A 7.94,36.2 6.67,34.92
  Top 0.61: U$9.6 7.62,32.86 6.67,33.66 6.67,34.29 | 6.67,34.29 6.67,34.92 6.67,35.08 5.08,36.67 X16.3 | U$9.5 6.83,34.13 6.67,34.29
N$16
  Top 0.406: X12.D+ 91.44,18.73 90.33,19.84 90.33,20.16 R2.1 R3.1
N$17
  Top 0.406: X12.D- 90.65,17.94 90.3,17.59 R1.1
N$18
  Top 0.406: LED9.A 8.47,29.47 7.62,30.32
  Top 0.61: U$9.8 7.62,30.32 6.51,31.43 | 6.51,31.43 6.67,31.59 | 6.67,31.59 6.67,31.52 6.48,31.4 | 6.48,31.4 6.22,31.72 4.76,33.18 X16.2 | U$9.7 6.67,31.59 | 6.51,31.43 6.48,31.4
N$19
  Top 0.406: LED11.A 8.47,38.52 6.83,40.16
  Top 0.61: U$10.8 6.83,40.16 6.51,40.48 6.51,41.27 | 6.51,41.27 6.67,41.43 U$10.7 | X16.4 6.5,40.17 6.51,41.27
N$20
  Top 0.406: D1B.K 53.66,56.04 54.77,57.15 54.93,57.3 54.93,61.12 57.86,64.05 | IC4.1 58.46,63.44 57.86,64.05 | 57.86,64.05 L2B.2
N$21
  Top 0.254: IC7.5 83.62,14.33 82.23,15.72 82.23,16.67 85.57,20 85.57,21.43 86.2,22.07 R3.2
N$22
  Top 0.406: 6K8.2 57.68,72.71 C2B.+ 56.25,71.02 52.7,67.47 52.72,67.45 L2B.1 52.77,65.04 L1B.1
N$23
  Top 0.406: LED10.A 7.62,45.72 6.83,44.93 6.83,43.97
  Top 0.61: U$10.6 7.46,42.7 6.51,43.66 | 6.51,43.66 3.92,43.66 X16.5 | U$10.5 6.83,43.97 6.51,43.66
N$24
  Top 0.305: OK2.1 RA41.1
N$25
  Top 0.406: U$1.4 15.56,53.34 16.51,54.29 Q1.3 19.36,54.31 RA1.1
N$26
  Top 0.406: C4B.2 63.66,55.89 R3B.2
N$27  (via drill 0.6)
  Top 0.305: IC2.9 80.33,69.53 80.64,69.22 83.82,69.22 v85.41,67.63
  Bottom 0.305: v85.41,67.63 R_SIM5.1
N$29
  Top 0.406: 14.45,62.55 U$2.4 Q4.3 19.21,62.85 RA5.1
N$30
  Top 0.406: RA2.2 23.01,53.81 Q1.1
N$31
  Top 0.406: Q3.1 22.07,49.69 22.7,50.32 RA3.2
N$32  (via drill 0.6)
  Top 0.305: IC2.26 v71.44,60.33
  Bottom 0.305: v71.44,60.33 72.87,60.33 76.68,64.14 76.68,66.04 79.53,68.9 97.95,68.9 X9.1
N$33
  Top 0.406: RA4.1 19.22,48.41 Q3.3 18.59,50.8 U$1.2
N$34  (via drill 0.6)
  Top 0.305: IC2.10 79.33,69.42 80.33,68.42 82.23,68.42 v83.03,67.63
  Bottom 0.305: v83.03,67.63 R_SIM6.1
N$35
  Top 0.305: OK2.3 RA42.1
N$36
  Top 0.254: C33.1 Q2.2 88.42,5.52 88.42,6.83 87.47,7.78 81.6,7.78 80.89,8.48 IC7.43
N$37
  Top 0.406: Q10.1 21.43,29.37 22.23,28.57 22.54,28.57 RA26.2
N$38  (via drill 0.6)
  Top 0.254: v87.95,14.29 C34.1 | IC7.44 81.39,8.93 81.92,8.41 86.49,8.41 Q2.1
  Bottom 0.254: Q2.1 88.27,13.97 v87.95,14.29
N$39
  Top 0.254: R5.1 96.04,11.27 | 96.04,11.27 R6.2 | IC7.4 86.5,13.83 88.11,12.22 89.22,12.22 90.49,10.95 90.49,10.32 91.44,9.37 95.41,9.37 95.89,9.84 95.89,11.11 96.04,11.27
N$40  (via drill 0.6)
  Top 0.305: IC2.16 73.33,69.07 75.25,67.15 v80.01,67.15
  Bottom 0.305: v80.01,67.15 R_SIM7.1
N$41
  Top 0.406: PCB1.10 53.18,77.31 53.18,75.25 49.05,71.12 49.05,63.81 R3RPI3.2
N$42
  Top 0.61: X11.1 IC2.60
N$43
  Top 0.406: RA6.2 22.86,62.39 22.38,61.91 21.43,61.91 Q4.1
N$44
  Top 0.406: RA7.2 22.86,58.26 22.22,57.62 Q5.1
N$45
  Top 0.406: U$2.2 15.72,60.01 17.14,58.58 Q5.3 19.21,58.56 RA8.1
N$46
  Top 0.406: U$9.4 15.4,34.29 15.94,34.83 15.94,37.37 18.26,39.69 Q6.3 19.22,38.11 RA9.1
N$47
  Top 0.406: Q6.1 23.49,38.74 RA10.2
N$48
  Top 0.406: Q7.1 23.49,34.45 RA11.2
N$49
  Top 0.406: U$9.2 15.56,31.59 18.73,34.77 Q7.3 19.22,33.19 RA12.1
N$50
  Top 0.406: RA13.1 19.21,45.39 Q8.3 16.51,46.67 16.03,46.2 16.03,44.61 15.4,43.97 U$10.4
N$51
  Top 0.406: Q8.1 21.91,45.72 22.7,46.51 23.33,46.52 RA14.2
N$52
  Top 0.406: Q9.1 22.23,42.39 22.54,42.7 22.54,42.71 RA15.2
N$53
  Top 0.406: U$10.2 15.72,41.43 17.62,43.34 Q9.3 19.22,42.72 RA16.1
N$54
  Top 0.406: LED1.C RA18.2
N$55
  Top 0.406: LED3.C RA19.1
N$56
  Top 0.406: LED6.C RA20.1
N$57
  Top 0.406: LED8.C RA21.2
N$58
  Top 0.406: LED9.C RA22.1
N$59
  Top 0.406: LED10.C RA23.2
N$60
  Top 0.406: LED11.C RA24.1
N$61
  Top 0.406: Q11.1 21.75,24.93 23.34,24.92 23.49,24.92 RA27.2
N$62
  Top 0.406: U$11.2 15.72,21.75 19.21,25.24 Q11.3 19.22,24.14 RA28.1
N$63  (1 unrouted)
N$64
  Top 0.406: LED4.C RA30.1
N$66
  Top 0.61: 6.09,5.26 2.86,8.5 2.86,10.16 U$12.8 U$12.7 | LED12.A 6.09,5.26 | 6.09,5.26 X17.5
N$67
  Top 0.61: U$12.6 0.95,13.02 | 0.95,13.02 0.95,7.78 6.35,2.38 9.1,2.38 X17.4 10.54,4.48 LED5.A | U$12.5 0.95,14.29 0.95,13.02
N$68
  Top 0.406: U$12.4 9.37,14.29 10.32,15.24 10.79,15.24 | 10.79,15.24 Q12.3 | RA31.1 10.63,15.24 10.79,15.24
N$69
  Top 0.406: Q12.1 15.56,14.29 16.99,15.72 RA32.2
N$70
  Top 0.406: Q13.1 16.19,10.64 16.83,11.27 16.99,11.27 RA33.2
N$71
  Top 0.406: U$12.2 12.55,11.75 | 12.55,11.75 Q13.3 | 12.55,11.75 12.55,13.03 RA34.1
N$72
  Top 0.406: LED5.C 14.29,8.41 RA35.2
N$73
  Top 0.406: RA36.1 20,9.21 19.68,9.53 9.53,9.53 8.41,8.41 LED12.C
N$74
  Top 0.305: RA37.2 19.21,10.79 19.68,10.32 20.8,10.32 21.11,10 21.43,9.68 21.43,6.99 20,5.56 19.27,5.56 X17.2
N$75
  Top 0.305: RA37.1 19.21,19.37 21.43,21.59 24.61,21.59 26.35,23.34 26.35,24.13 26.67,24.45 29.47,24.45 OK1.1
N$76
  Top 0.305: RA38.2 21.27,10.95 22.07,10.16 22.07,4.85 X17.1
N$77
  Top 0.305: RA38.1 21.27,14.45 20,15.72 20,19.05 21.75,20.8 24.92,20.8 26.67,22.54 31.91,22.54 32.07,22.7 OK1.3
N$80
  Top 0.254: LED13.C RA43.2
N$81
  Top 0.254: LED14.C RA44.2
PA0  (via drill 0.6)
  Top 0.305: IC1.40 54.13,42.08 52.23,43.97 51.44,43.97 50.96,44.45 50.96,46.35 49.69,47.62 46.04,47.62 43.18,50.48 43.18,64.61 42.23,65.56 28.26,65.56 v27.94,65.25 | v16.67,78.11 U$8.7
  Bottom 0.305: v27.94,65.25 16.67,76.52 v16.67,78.11
PA1  (via drill 0.6)
  Top 0.305: IC1.41 53.33,41.92 51.91,43.34 51.12,43.34 50.32,44.13 50.32,45.88 49.21,46.99 45.72,46.99 42.55,50.16 42.55,64.29 41.91,64.93 29.69,64.93 v29.37,64.61 | v16.83,70.33 16.83,72.22 R_RST5.2
  Top 0.406: R_RST5.2 R_RST4.1
  Bottom 0.305: v29.37,64.61 28.89,64.14 27.46,64.14 21.27,70.33 v16.83,70.33
PA2
  Top 0.305: IC1.42 52.53,41.77 51.59,42.7 50.01,42.7 49.21,41.91 46.2,41.91 44.61,40.32 25.88,40.32 25.08,41.12 25.08,44.29 24.77,44.61 RA14.1
PA3
  Top 0.305: IC1.43 51.73,41.78 51.44,42.07 50.32,42.07 49.53,41.27 46.67,41.27 45.09,39.69 25.24,39.69 24.61,40.32 23.5,40.32 RA15.1
PA4
  Top 0.305: IC1.44 50.73,40.73 50.64,40.64 47.15,40.64 45.56,39.05 26.67,39.05 24.61,36.99 RA10.1
PA5
  Top 0.305: IC1.1 46.55,38.92 46.04,38.42 27.15,38.42 25.24,36.51 25.24,33.02 24.61,32.38 RA11.1
PA6
  Top 0.305: IC1.2 46.86,38.12 46.51,37.78 27.46,37.78 25.88,36.2 25.88,31.75 24.61,30.48 RA26.1
PA7
  Top 0.305: IC1.3 47.17,37.33 46.99,37.15 27.78,37.15 26.51,35.88 26.51,31.43 25.24,30.16 25.24,27.15 24.77,26.67 RA27.1
PB0
  Top 0.305: RA32.1 16.99,19.05 20.95,23.02 24.13,23.02 25.08,23.97 25.08,26.04 25.88,26.83 25.88,29.84 27.15,31.11 27.15,35.56 28.1,36.51 48.42,36.51 48.56,36.52 IC1.4
PB1
  Top 0.305: IC1.5 47.78,35.72 47.62,35.88 28.42,35.88 27.78,35.24 27.78,30.8 26.51,29.53 26.51,26.51 25.72,25.72 25.72,23.65 24.45,22.38 21.27,22.38 18.26,19.37 18.26,15.24 | 18.26,15.24 | 18.26,15.24 16.99,13.97 RA33.1
PB2
  Top 0.305: IC1.6 47.31,34.92 46.99,35.24 30,35.24 29.53,34.77 OK1.8 29.53,29.53 28.41,28.41 RA39.2
PB3
  Top 0.305: IC1.7 46.84,34.12 46.35,34.61 32.38,34.61 32.07,34.29 OK1.6 32.07,28.73 32.38,28.42 RA40.2
PC0
  Top 0.305: IC1.10 47.92,31.73 47.31,31.11 47.31,29.21 39.69,21.59 26.83,21.59 25.56,20.32 I2C.2
PC1
  Top 0.305: 49.13,30.87 IC1.11 49.05,30.85 49.05,30 39.85,20.8 28.73,20.8 28.1,20.16 I2C.3
PC4
  Top 0.254: LED14.A 45.72,15.88 45.4,15.56
  Top 0.305: IC1.14 52.53,26.65 52.07,26.19 52.07,20.32 47.31,15.56 45.4,15.56 44.45,15.56 RA42.2
PC5  (via drill 0.6)
  Top 0.254: LED13.A 47.62,17.94 v46.83,17.14 | RA41.2
  Top 0.305: IC1.15 53.33,26.5 52.7,25.88 52.7,20 47.47,14.76 46.2,14.76 RA41.2
  Bottom 0.254: v46.83,17.14 46.83,15.4 RA41.2
  other vias: 45.72,14.29
PC6
  Top 0.305: IC1.16 54.13,26.19 53.34,25.4 53.34,19.68 47.78,14.13 47.78,11.75 49.05,10.48 U$3.P$4
  Bottom 0.406: U$4.P$12 77.31,5.4 76.04,5.4 75.09,6.35 58.1,6.35 53.98,10.48 U$3.P$4
PC7
  Top 0.305: IC1.17 54.93,26.04 53.98,25.08 53.98,19.37 48.42,13.81 48.42,12.06 48.74,11.75 52.23,11.75 52.7,11.27 52.7,8.41 52.23,7.94 U$3.P$3
  Bottom 0.406: U$4.P$10 74.77,5.4 57.15,5.4 54.61,7.94 U$3.P$3
PD0  (via drill 0.6)
  Top 0.305: IC1.20 57.33,26.33 v58.1,25.56 58.1,22.23 50.48,14.61 U$3.P$5
  Bottom 0.406: U$4.P$5B 70.01,23.18 60.48,23.18 v58.1,25.56
PD1  (via drill 0.6)
  Top 0.305: IC1.21 58.13,28.07 58.58,27.62 61.12,27.62 62.87,29.37 67.79,29.37 70.17,31.75 70.17,38.89 v69.06,40.01 | v80.49,61.91 74.93,61.91 v73.98,62.87
  Bottom 0.305: v69.06,40.01 68.58,40.48 68.58,60.8 69.37,61.59 72.39,61.59 73.66,62.87 v73.98,62.87 | R_SIM7.2 ZD1B2.C 80.53,61.87 v80.49,61.91
PD2  (via drill 0.6)
  Top 0.305: IC1.22 58.93,28.54 59.21,28.26 60.64,28.26 62.55,30.16 67.31,30.16 69.53,32.38 69.53,37.15 68.74,37.94 v68.74,38.42 | v75.41,64.77 75.72,64.45 84.14,64.45 v85.41,63.18
  Bottom 0.305: v68.74,38.42 67.94,39.21 67.94,61.59 68.74,62.39 71.91,62.39 73.5,63.98 74.61,63.98 v75.41,64.77 | R_SIM5.2 v85.41,63.18 ZD1B4.C
PD3  (via drill 0.6)
  Top 0.305: IC1.23 66.96,30.93 68.74,32.7 68.74,36.2 v67.63,37.31 | v73.5,65.09 75.41,63.18 v83.03,63.18
  Bottom 0.305: v73.5,65.09 73.18,65.09 71.28,63.18 68.58,63.18 67.31,61.91 67.31,37.62 v67.63,37.31 | R_SIM6.2 v83.03,63.18 ZD1B3.C
PD4  (via drill 0.6)
  Top 0.305: IC1.24 66.65,31.73 67.94,33.02 67.94,35.4 v67.63,35.72 | v66.04,62.87 66.04,55.09 65.09,54.13 65.09,47.94 v66.2,46.83 | v94.3,70.8 93.97,70.8 R_SIM4.2 94.46,70.17
  Bottom 0.305: v66.04,62.87 66.99,63.82 70.8,63.82 73.34,66.36 76.04,66.36 79.38,69.69 93.19,69.69 v94.3,70.8 ZD1B5.C | v67.63,35.72 66.52,36.83 66.52,46.51 v66.2,46.83
PD5  (via drill 0.6)
  Top 0.406: IC1.25 65.7,32.52 v66.04,32.86 | v60.96,25.88 IC5.3
  Bottom 0.406: v66.04,32.86 66.04,30.96 v60.96,25.88
PD6  (via drill 0.6)
  Top 0.406: IC1.26 64.6,33.33 65.56,34.29 v66.83,34.29 | v63.5,26.35 IC5.1
  Bottom 0.406: v66.83,34.29 67.47,33.66 67.47,30.32 v63.5,26.35
PD7  (via drill 0.6)
  Top 0.406: IC1.27 59.05,34.12 58.58,33.66 58.58,31.27 v60.33,29.53 | v59.53,26.51 59.69,26.35 IC5.4
  Bottom 0.406: v60.33,29.53 59.69,28.89 59.69,26.67 v59.53,26.51
PDI_DTA  (via drill 0.6)
  Top 0.305: v47.94,54.29 47.15,55.09 47.15,69.53 44.77,71.91 36.35,71.91 33.97,74.3 29.84,74.3 SV1.1
  Top 0.406: IC1.34 58.93,45.12 v58.42,45.56
  Bottom 0.406: v58.42,45.56 58.42,46.51 55.88,49.05 51.59,49.05 49.69,50.96 49.69,52.55 v47.94,54.29
PE0
  Top 0.254: RA6.1 arc-90 RA6.1
  Top 0.305: IC1.28 65.25,34.92 66.52,36.2 66.52,42.23 58.42,50.32 48.26,50.32 45.72,52.86 45.72,65.88 43.5,68.1 26.35,68.1 24.77,66.52 24.77,61.12 24.13,60.48 RA6.1
PE1
  Top 0.254: 23.66,56.2 RA7.1
  Top 0.305: IC1.29 65.09,35.73 65.88,36.51 65.88,41.91 58.26,49.53 48.1,49.53 45.09,52.55 45.09,65.56 43.18,67.47 26.67,67.47 25.4,66.2 25.4,57.47 24.13,56.2 23.66,56.2
PE2  (via drill 0.6)
  Top 0.406: IC1.32 61.94,38.12 62.23,38.42 62.23,39.69 v61.44,40.48 | v50.96,51.28 49.37,52.86 49.37,55.72 R3RPI2.1
  Bottom 0.406: v61.44,40.48 61.28,40.32 60.48,40.32 59.53,41.27 59.53,46.51 56.2,49.85 52.39,49.85 v50.96,51.28
PE3  (via drill 0.6)
  Top 0.406: IC1.33 60.57,39.13 60.33,39.37 60.33,41.43 v60.64,41.75 | v50.96,52.86 v50.97,52.86 50.32,53.51 50.32,60.8 49.69,60.8 R3RPI3.1
  Bottom 0.406: v60.64,41.75 60.33,42.07 60.33,46.83 56.36,50.8 53.02,50.8 v50.96,52.86
PR0  (via drill 0.6)
  Top 0.305: IC1.36 57.33,42.53 56.52,43.34 56.52,44.29 56.83,44.61 56.83,45.56 55.88,46.51 v55.72,46.51 | v45.72,50.48 44.45,51.75 44.45,65.25 42.86,66.83 26.99,66.83 26.04,65.88 26.04,57.15 24.92,56.04 24.92,53.34 23.81,52.23 RA2.1
  Bottom 0.305: v55.72,46.51 54.61,47.62 50.64,47.62 48.42,49.85 46.35,49.85 v45.72,50.48
PR1  (via drill 0.6)
  Top 0.305: IC1.37 56.53,42.37 55.88,43.02 55.88,44.93 v55.72,45.09 | v46.99,48.9 45.72,48.9 43.81,50.8 43.81,64.93 42.55,66.2 27.3,66.2 26.67,65.56 26.67,56.83 25.56,55.72 25.56,50.16 23.81,48.42 RA3.1
  Bottom 0.305: v55.72,45.09 53.82,46.99 50.16,46.99 48.26,48.9 v46.99,48.9
PWR  (via drill 0.6)
  Top 0.406: v8.5,79.14 8.73,79.38
  Top 0.61: U$8.2 U$8.1 8.73,79.38
  Bottom 1.016: J1.1 v8.5,79.14
RS_485_A
  Top 0.254: IC5.6 60.96,9.05 57.15,5.24 57.15,3.02 X1.2
RS_485_B
  Top 0.254: IC5.7 62.23,16.67 61.59,16.03 61.59,8.89 59.53,6.83 X1.3
SIM900PWRKEY
  Top 0.305: IC2.1 88.33,73.09 88.9,73.66 93.97,73.66 R_SIM4.1
SIM_CLK
  Top 0.305: IC2.32 70.45,54.33 71.28,53.5 71.28,52.07 70.48,51.28 70.48,46.83 72.23,45.09 R_SIM3.1
SIM_DTA
  Top 0.305: IC2.31 69,55.24 67.31,55.24 65.88,53.82 65.88,48.58 71.12,43.34 71.12,41.75 72.55,40.32 R_SIM1.2
SIM_DTA_S  (via drill 0.6)
  Top 0.305: R_SIM1.1 75.56,40.01 IC6.5 | v94.3,40.32 U$7.C7 100.65,40.32
  Bottom 0.305: R_SIM1.1 76.04,40.32 75.09,41.27 75.09,48.58 77.15,50.64 85.72,50.64 87.79,48.58 87.79,41.59 89.06,40.32 v94.3,40.32
  other vias: 75.88,40.32
SIM_RST
  Top 0.305: IC2.33 67.3,53.33 66.67,52.7 66.67,48.9 72.87,42.7 R_SIM2.2
SIM_VCC
  Top 0.305: IC2.30 70.99,56.33 71.91,55.4 71.91,51.28 71.28,50.64 71.28,47.47 71.91,46.83 84.45,46.83 84.77,46.51 84.77,45.09 85.41,44.45 89.22,44.45 89.85,43.81 89.85,36.35 88.74,35.24 U$7.C1 85.41,35.24 85.09,34.92 85.09,30.19 C21.1
SIMCLS_S  (via drill 0.6)
  Top 0.305: R_SIM3.2 v77.15,45.09 77.31,44.93 77.31,38.89 76.22,37.8 IC6.4 | v86.04,40.32 U$7.C3
  Bottom 0.305: v77.15,45.09 77.15,48.42 77.79,49.05 85.09,49.05 86.2,47.94 86.2,40.48 v86.04,40.32
SIMRSTS  (via drill 0.6)
  Top 0.305: v76.04,42.7 R_SIM2.1 74.93,42.7 74.45,42.23 74.45,38.42 74.92,37.96 IC6.6 | v88.42,37.78 U$7.C2
  Bottom 0.305: v76.04,42.7 76.04,48.42 77.47,49.85 85.41,49.85 87,48.26 87,39.21 v88.42,37.78
USB_RX  (via drill 0.6)
  Top 0.254: IC7.40 79.39,11.41 78.9,11.91 77.63,11.91 76.99,11.27 75.56,11.27 74.77,12.06 74.77,13.49 74.14,14.13 72.55,14.13 71.91,14.76 70.01,14.76 67.94,16.83 65.88,16.83 v65.25,17.46 | v50.8,24.45 50.01,25.24 50.01,28.26 50.75,29 50.8,29 IC1.12
  Bottom 0.254: v65.25,17.46 57.78,17.46 v50.8,24.45
USB_TX  (via drill 0.6)
  Top 0.254: IC7.39 78.89,9.2 78.74,9.05 77.79,9.05 76.2,10.64 75.41,10.64 74.14,11.91 74.14,13.18 73.82,13.49 72.23,13.49 71.6,14.13 69.85,14.13 67.79,16.19 64.93,16.19 v64.61,15.88 | v51.12,26.99 51.75,27.62 51.75,29.1 IC1.13
  Bottom 0.254: v64.61,15.88 63.98,16.51 57.15,16.51 49.69,23.97 49.69,25.56 v51.12,26.99
V_USB  (via drill 0.6)
  Top 0.305: X12.VBUS v93.14,16.46 | v92.71,26.04 92.73,26.19 D3.A
  Top 0.61: v95.73,2.54 C27.+ | R5.2 99.67,10.93 v99.38,10.64 99.38,9.26 L6.2
  Bottom 0.254: 93.03,16.57 v93.14,16.46
  Bottom 0.61: v93.14,16.46 95.73,13.87 | 95.73,13.87 v95.73,2.54 | 95.73,13.87 98.96,10.64 v99.38,10.64
  Bottom 1.016: v92.71,26.04 94.46,24.29 94.46,17.46 93.56,16.57 93.03,16.57

## Text on the board
Top: 2016
Bottom: 2016